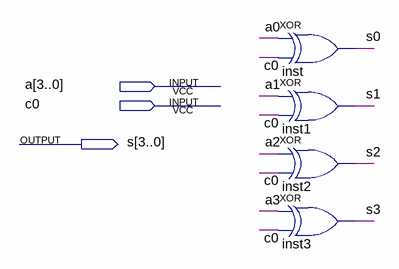
[diagram p0: schematic sheet]
// Quartus schematic xor2_4b.bdf as structural Verilog: 4 symbols, 3 pins
module xor2_4b (
  input  [3:0] a,
  input  c0,
  output [3:0] s
);

  xor inst (s[0], a[0], c0);
  xor inst1 (s[1], a[1], c0);
  xor inst2 (s[2], a[2], c0);
  xor inst3 (s[3], a[3], c0);
endmodule
